# EasyEDA schematic SCH_AVlabs AV-GMK MK I_2024-01-18.json
TITLE: AVlabs AV-GMK MKI; REV: 1.0; Date: 2023-08-29; Sheet: 1/1; Drawn By: Avesta MOLAEI; Company: AVLABS
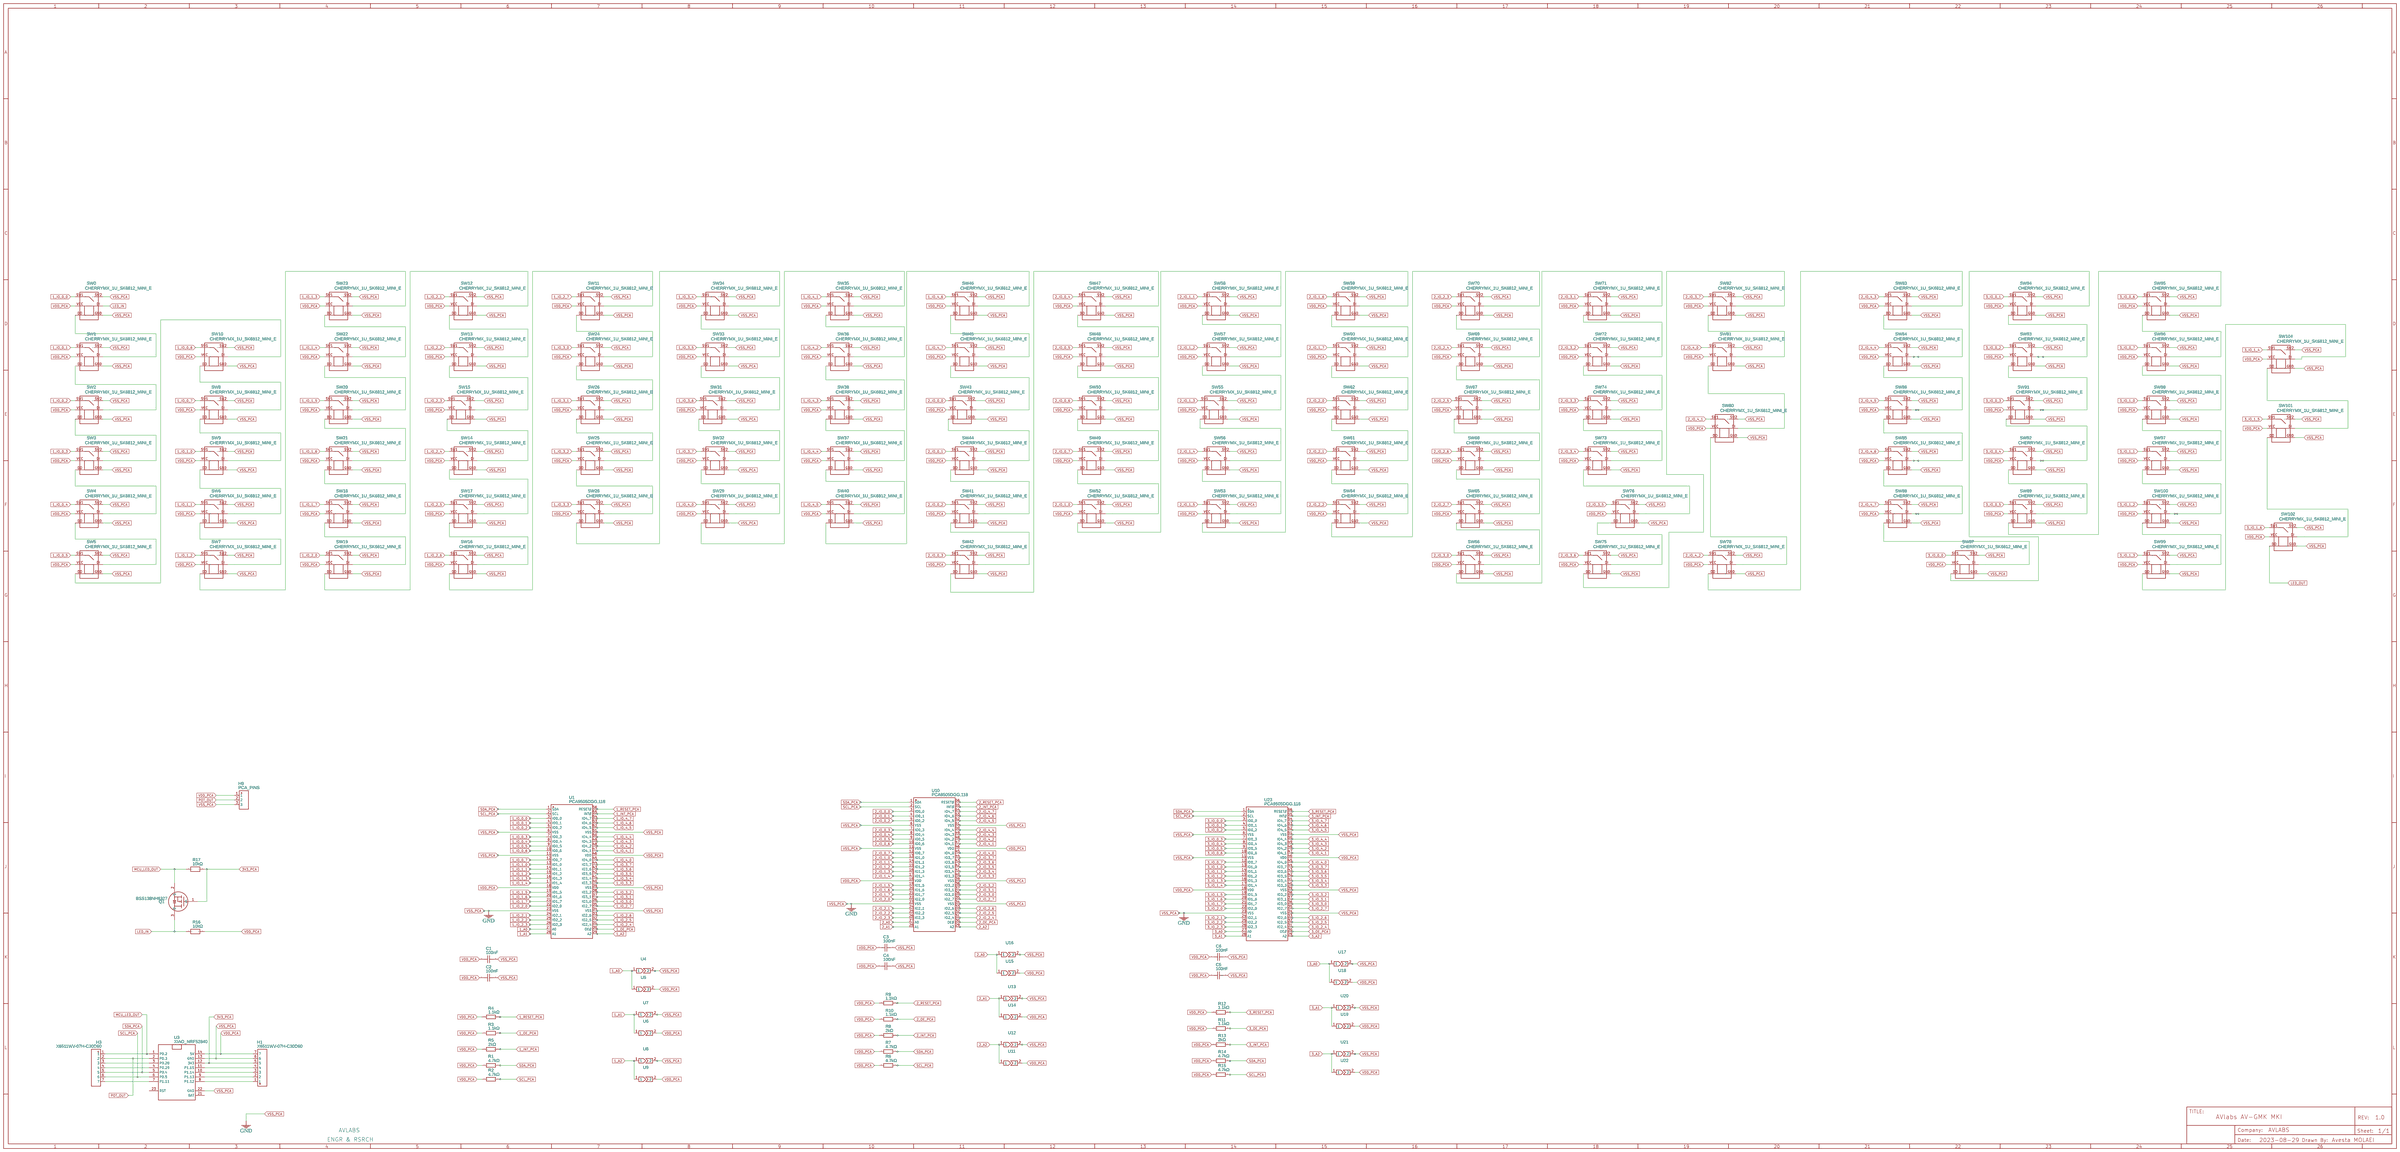
[diagram p0: schematic sheet]

## Parts
C1  100nF  [C0805]
C2  100nF  [C0805]
C3  100nF  [C0805]
C4  100nF  [C0805]
C5  100nF  [C0805]
C6  100nF  [C0805]
H1  X6511WV-07H-C30D60  [HDR-TH_7P-P2.54-V-M]
H3  X6511WV-07H-C30D60  [HDR-TH_7P-P2.54-V-M]
H9  PCA_PINS  [HDR-TH_3P-P2.54-V-M]
Q1  BSS138NH6327  [SOT-23-3_L2.9-W1.3-P1.90-LS2.4-BR]
R1  4.7kΩ  [R0805]
R2  4.7kΩ  [R0805]
R3  1.1kΩ  [R0805]
R4  1.1kΩ  [R0805]
R5  2kΩ  [R0805]
R6  4.7kΩ  [R0805]
R7  4.7kΩ  [R0805]
R8  2kΩ  [R0805]
R9  1.1kΩ  [R0805]
R10  1.1kΩ  [R0805]
R11  1.1kΩ  [R0805]
R12  1.1kΩ  [R0805]
R13  2kΩ  [R0805]
R14  4.7kΩ  [R0805]
R15  4.7kΩ  [R0805]
R16  10kΩ  [R0805]
R17  10kΩ  [R0805]
SW0  CHERRYMX_1U_SK6812_MINI_E  [CHERRYMX_1U_SK6812_MINI-E]
SW1  CHERRYMX_1U_SK6812_MINI_E  [CHERRYMX_1U_SK6812_MINI-E]
SW2  CHERRYMX_1U_SK6812_MINI_E  [CHERRYMX_1U_SK6812_MINI-E]
SW3  CHERRYMX_1U_SK6812_MINI_E  [CHERRYMX_1U_SK6812_MINI-E]
SW4  CHERRYMX_1U_SK6812_MINI_E  [CHERRYMX_1U_SK6812_MINI-E]
SW5  CHERRYMX_1U_SK6812_MINI_E  [CHERRYMX_1U_SK6812_MINI-E]
SW6  CHERRYMX_1U_SK6812_MINI_E  [CHERRYMX_1U_SK6812_MINI-E]
SW7  CHERRYMX_1U_SK6812_MINI_E  [CHERRYMX_1U_SK6812_MINI-E]
SW8  CHERRYMX_1U_SK6812_MINI_E  [CHERRYMX_1U_SK6812_MINI-E]
SW9  CHERRYMX_1U_SK6812_MINI_E  [CHERRYMX_1U_SK6812_MINI-E]
SW10  CHERRYMX_1U_SK6812_MINI_E  [CHERRYMX_1U_SK6812_MINI-E]
SW11  CHERRYMX_1U_SK6812_MINI_E  [CHERRYMX_1U_SK6812_MINI-E]
SW12  CHERRYMX_1U_SK6812_MINI_E  [CHERRYMX_1U_SK6812_MINI-E]
SW13  CHERRYMX_1U_SK6812_MINI_E  [CHERRYMX_1U_SK6812_MINI-E]
SW14  CHERRYMX_1U_SK6812_MINI_E  [CHERRYMX_1U_SK6812_MINI-E]
SW15  CHERRYMX_1U_SK6812_MINI_E  [CHERRYMX_1U_SK6812_MINI-E]
SW16  CHERRYMX_1U_SK6812_MINI_E  [CHERRYMX_1U_SK6812_MINI-E]
SW17  CHERRYMX_1U_SK6812_MINI_E  [CHERRYMX_1U_SK6812_MINI-E]
SW18  CHERRYMX_1U_SK6812_MINI_E  [CHERRYMX_1U_SK6812_MINI-E]
SW19  CHERRYMX_1U_SK6812_MINI_E  [CHERRYMX_1U_SK6812_MINI-E]
SW20  CHERRYMX_1U_SK6812_MINI_E  [CHERRYMX_1U_SK6812_MINI-E]
SW21  CHERRYMX_1U_SK6812_MINI_E  [CHERRYMX_1U_SK6812_MINI-E]
SW22  CHERRYMX_1U_SK6812_MINI_E  [CHERRYMX_1U_SK6812_MINI-E]
SW23  CHERRYMX_1U_SK6812_MINI_E  [CHERRYMX_1U_SK6812_MINI-E]
SW24  CHERRYMX_1U_SK6812_MINI_E  [CHERRYMX_1U_SK6812_MINI-E]
SW25  CHERRYMX_1U_SK6812_MINI_E  [CHERRYMX_1U_SK6812_MINI-E]
SW26  CHERRYMX_1U_SK6812_MINI_E  [CHERRYMX_1U_SK6812_MINI-E]
SW28  CHERRYMX_1U_SK6812_MINI_E  [CHERRYMX_1U_SK6812_MINI-E]
SW29  CHERRYMX_1U_SK6812_MINI_E  [CHERRYMX_1U_SK6812_MINI-E]
SW31  CHERRYMX_1U_SK6812_MINI_E  [CHERRYMX_1U_SK6812_MINI-E]
SW32  CHERRYMX_1U_SK6812_MINI_E  [CHERRYMX_1U_SK6812_MINI-E]
SW33  CHERRYMX_1U_SK6812_MINI_E  [CHERRYMX_1U_SK6812_MINI-E]
SW34  CHERRYMX_1U_SK6812_MINI_E  [CHERRYMX_1U_SK6812_MINI-E]
SW35  CHERRYMX_1U_SK6812_MINI_E  [CHERRYMX_1U_SK6812_MINI-E]
SW36  CHERRYMX_1U_SK6812_MINI_E  [CHERRYMX_1U_SK6812_MINI-E]
SW37  CHERRYMX_1U_SK6812_MINI_E  [CHERRYMX_1U_SK6812_MINI-E]
SW38  CHERRYMX_1U_SK6812_MINI_E  [CHERRYMX_1U_SK6812_MINI-E]
SW40  CHERRYMX_1U_SK6812_MINI_E  [CHERRYMX_1U_SK6812_MINI-E]
SW41  CHERRYMX_1U_SK6812_MINI_E  [CHERRYMX_1U_SK6812_MINI-E]
SW42  CHERRYMX_1U_SK6812_MINI_E  [CHERRYMX_1U_SK6812_MINI-E]
SW43  CHERRYMX_1U_SK6812_MINI_E  [CHERRYMX_1U_SK6812_MINI-E]
SW44  CHERRYMX_1U_SK6812_MINI_E  [CHERRYMX_1U_SK6812_MINI-E]
SW45  CHERRYMX_1U_SK6812_MINI_E  [CHERRYMX_1U_SK6812_MINI-E]
SW46  CHERRYMX_1U_SK6812_MINI_E  [CHERRYMX_1U_SK6812_MINI-E]
SW47  CHERRYMX_1U_SK6812_MINI_E  [CHERRYMX_1U_SK6812_MINI-E]
SW48  CHERRYMX_1U_SK6812_MINI_E  [CHERRYMX_1U_SK6812_MINI-E]
SW49  CHERRYMX_1U_SK6812_MINI_E  [CHERRYMX_1U_SK6812_MINI-E]
SW50  CHERRYMX_1U_SK6812_MINI_E  [CHERRYMX_1U_SK6812_MINI-E]
SW52  CHERRYMX_1U_SK6812_MINI_E  [CHERRYMX_1U_SK6812_MINI-E]
SW53  CHERRYMX_1U_SK6812_MINI_E  [CHERRYMX_1U_SK6812_MINI-E]
SW55  CHERRYMX_1U_SK6812_MINI_E  [CHERRYMX_1U_SK6812_MINI-E]
SW56  CHERRYMX_1U_SK6812_MINI_E  [CHERRYMX_1U_SK6812_MINI-E]
SW57  CHERRYMX_1U_SK6812_MINI_E  [CHERRYMX_1U_SK6812_MINI-E]
SW58  CHERRYMX_1U_SK6812_MINI_E  [CHERRYMX_1U_SK6812_MINI-E]
SW59  CHERRYMX_1U_SK6812_MINI_E  [CHERRYMX_1U_SK6812_MINI-E]
SW60  CHERRYMX_1U_SK6812_MINI_E  [CHERRYMX_1U_SK6812_MINI-E]
SW61  CHERRYMX_1U_SK6812_MINI_E  [CHERRYMX_1U_SK6812_MINI-E]
SW62  CHERRYMX_1U_SK6812_MINI_E  [CHERRYMX_1U_SK6812_MINI-E]
SW64  CHERRYMX_1U_SK6812_MINI_E  [CHERRYMX_1U_SK6812_MINI-E]
SW65  CHERRYMX_1U_SK6812_MINI_E  [CHERRYMX_1U_SK6812_MINI-E]
SW66  CHERRYMX_1U_SK6812_MINI_E  [CHERRYMX_1U_SK6812_MINI-E]
SW67  CHERRYMX_1U_SK6812_MINI_E  [CHERRYMX_1U_SK6812_MINI-E]
SW68  CHERRYMX_1U_SK6812_MINI_E  [CHERRYMX_1U_SK6812_MINI-E]
SW69  CHERRYMX_1U_SK6812_MINI_E  [CHERRYMX_1U_SK6812_MINI-E]
SW70  CHERRYMX_1U_SK6812_MINI_E  [CHERRYMX_1U_SK6812_MINI-E]
SW71  CHERRYMX_1U_SK6812_MINI_E  [CHERRYMX_1U_SK6812_MINI-E]
SW72  CHERRYMX_1U_SK6812_MINI_E  [CHERRYMX_1U_SK6812_MINI-E]
SW73  CHERRYMX_1U_SK6812_MINI_E  [CHERRYMX_1U_SK6812_MINI-E]
SW74  CHERRYMX_1U_SK6812_MINI_E  [CHERRYMX_1U_SK6812_MINI-E]
SW75  CHERRYMX_1U_SK6812_MINI_E  [CHERRYMX_1U_SK6812_MINI-E]
SW76  CHERRYMX_1U_SK6812_MINI_E  [CHERRYMX_1U_SK6812_MINI-E]
SW78  CHERRYMX_1U_SK6812_MINI_E  [CHERRYMX_1U_SK6812_MINI-E]
SW80  CHERRYMX_1U_SK6812_MINI_E  [CHERRYMX_1U_SK6812_MINI-E]
SW81  CHERRYMX_1U_SK6812_MINI_E  [CHERRYMX_1U_SK6812_MINI-E]
SW82  CHERRYMX_1U_SK6812_MINI_E  [CHERRYMX_1U_SK6812_MINI-E]
SW83  CHERRYMX_1U_SK6812_MINI_E  [CHERRYMX_1U_SK6812_MINI-E]
SW84  CHERRYMX_1U_SK6812_MINI_E  [CHERRYMX_1U_SK6812_MINI-E]
SW85  CHERRYMX_1U_SK6812_MINI_E  [CHERRYMX_1U_SK6812_MINI-E]
SW86  CHERRYMX_1U_SK6812_MINI_E  [CHERRYMX_1U_SK6812_MINI-E]
SW87  CHERRYMX_1U_SK6812_MINI_E  [CHERRYMX_1U_SK6812_MINI-E]
SW88  CHERRYMX_1U_SK6812_MINI_E  [CHERRYMX_1U_SK6812_MINI-E]
SW89  CHERRYMX_1U_SK6812_MINI_E  [CHERRYMX_1U_SK6812_MINI-E]
SW91  CHERRYMX_1U_SK6812_MINI_E  [CHERRYMX_1U_SK6812_MINI-E]
SW92  CHERRYMX_1U_SK6812_MINI_E  [CHERRYMX_1U_SK6812_MINI-E]
SW93  CHERRYMX_1U_SK6812_MINI_E  [CHERRYMX_1U_SK6812_MINI-E]
SW94  CHERRYMX_1U_SK6812_MINI_E  [CHERRYMX_1U_SK6812_MINI-E]
SW95  CHERRYMX_1U_SK6812_MINI_E  [CHERRYMX_1U_SK6812_MINI-E]
SW96  CHERRYMX_1U_SK6812_MINI_E  [CHERRYMX_1U_SK6812_MINI-E]
SW97  CHERRYMX_1U_SK6812_MINI_E  [CHERRYMX_1U_SK6812_MINI-E]
SW98  CHERRYMX_1U_SK6812_MINI_E  [CHERRYMX_1U_SK6812_MINI-E]
SW99  CHERRYMX_1U_SK6812_MINI_E  [CHERRYMX_1U_SK6812_MINI-E]
SW100  CHERRYMX_1U_SK6812_MINI_E  [CHERRYMX_1U_SK6812_MINI-E]
SW101  CHERRYMX_1U_SK6812_MINI_E  [CHERRYMX_1U_SK6812_MINI-E]
SW102  CHERRYMX_1U_SK6812_MINI_E  [CHERRYMX_1U_SK6812_MINI-E]
SW104  CHERRYMX_1U_SK6812_MINI_E  [CHERRYMX_1U_SK6812_MINI-E]
U1  PCA9505DGG,118  [TSSOP-56_L14.0-W6.1-P0.50-LS8.1-BL]
U3  XIAO_NRF52840  [XIAO-NRF52840]
U4  beautiful-solderbridge  [BEAUTIFUL-SOLDER-BRIDGE]
U5  beautiful-solderbridge  [BEAUTIFUL-SOLDER-BRIDGE]
U6  beautiful-solderbridge  [BEAUTIFUL-SOLDER-BRIDGE]
U7  beautiful-solderbridge  [BEAUTIFUL-SOLDER-BRIDGE]
U8  beautiful-solderbridge  [BEAUTIFUL-SOLDER-BRIDGE]
U9  beautiful-solderbridge  [BEAUTIFUL-SOLDER-BRIDGE]
U10  PCA9505DGG,118  [TSSOP-56_L14.0-W6.1-P0.50-LS8.1-BL]
U11  beautiful-solderbridge  [BEAUTIFUL-SOLDER-BRIDGE]
U12  beautiful-solderbridge  [BEAUTIFUL-SOLDER-BRIDGE]
U13  beautiful-solderbridge  [BEAUTIFUL-SOLDER-BRIDGE]
U14  beautiful-solderbridge  [BEAUTIFUL-SOLDER-BRIDGE]
U15  beautiful-solderbridge  [BEAUTIFUL-SOLDER-BRIDGE]
U16  beautiful-solderbridge  [BEAUTIFUL-SOLDER-BRIDGE]
U17  beautiful-solderbridge  [BEAUTIFUL-SOLDER-BRIDGE]
U18  beautiful-solderbridge  [BEAUTIFUL-SOLDER-BRIDGE]
U19  beautiful-solderbridge  [BEAUTIFUL-SOLDER-BRIDGE]
U20  beautiful-solderbridge  [BEAUTIFUL-SOLDER-BRIDGE]
U21  beautiful-solderbridge  [BEAUTIFUL-SOLDER-BRIDGE]
U22  beautiful-solderbridge  [BEAUTIFUL-SOLDER-BRIDGE]
U23  PCA9505DGG,118  [TSSOP-56_L14.0-W6.1-P0.50-LS8.1-BL]

## Library data of the parts
C1-C6 = GRM21BR71H104KA01L: Supplier: LCSC; Manufacturer: muRata(村田); Supplier Part: C77082; JLCPCB Part Class: Extended Part
H1 H3 = X6511WV-07H-C30D60: Supplier: LCSC; Supplier Part: C706879; Manufacturer: XKB Connectivity(中国星坤); Contributor: LCSC; JLCPCB Part Class: Extended Part
H9 = X6511WV-03H-C30D60: Supplier: LCSC; Supplier Part: C706875; Manufacturer: XKB Connectivity(中国星坤); Contributor: LCSC; JLCPCB Part Class: Extended Part
Q1 = BSS138NH6327: Contributor: LCSC; Supplier: LCSC; Manufacturer: Infineon(英飞凌); Supplier Part: C94638; JLCPCB Part Class: Extended Part; link: https://lcsc.com/eda_search?q=C94638&%26type=1&ref=editor
R1 R2 R6 R7 R14 R15 = RN732ATTD4701B25: Supplier: LCSC; Supplier Part: C186491; Manufacturer: KOA; Resistance (Ohms): 4.7K; Contributor: LCSC; JLCPCB Part Class: Extended Part
R3 R4 R9-R12 = RN732ATTD1101B25: Supplier: LCSC; Supplier Part: C186476; Manufacturer: KOA; Resistance (Ohms): 1.1K; Contributor: LCSC; JLCPCB Part Class: Extended Part
R5 R8 R13 = RN732ATTD2001B25: Supplier: LCSC; Supplier Part: C186482; Manufacturer: KOA; Resistance (Ohms): 2K; Contributor: LCSC; JLCPCB Part Class: Extended Part
R16 R17 = RN732ATTD1002B10: Contributor: LCSC; Supplier: LCSC; Supplier Part: C782227; Manufacturer: KOA; JLCPCB Part Class: Extended Part; link: https://lcsc.com/eda_search?q=C782227&%26type=1&ref=editor
SW0-SW26 SW28 SW29 SW31-SW38 SW40-SW50 SW52 SW53 SW55-SW62 SW64-SW76 SW78 SW80-SW89 SW91-SW102 SW104 = CHERRYMX_1U_SK6812_MINI_E: Contributor: Andrea Peron
U1 U10 U23 = PCA9505DGG,118: Supplier: LCSC; Supplier Part: C2669685; Manufacturer: NXP(恩智浦); Contributor: LCSC; JLCPCB Part Class: Extended Part
U3 = XIAO_NRF52840: Contributor: Kushal Soni
U4-U9 U11-U22 = beautiful-solderbridge: Contributor: loic.rochat

## Nets
3V3_PCA: H1.5 Q1.1(G) R17.2 U3.12(3V3)
GND: C1.2 C2.2 C3.2 C4.2 C5.2 C6.2 H1.6 H9.3 SW0.GND SW0.SW2 SW1.GND SW1.SW2 SW2.GND SW2.SW2 SW3.GND SW3.SW2 SW4.GND SW4.SW2 SW5.GND SW5.SW2 SW6.GND SW6.SW2 SW7.GND SW7.SW2 SW8.GND SW8.SW2 SW9.GND SW9.SW2 SW10.GND SW10.SW2 SW11.GND SW11.SW2 SW12.GND SW12.SW2 SW13.GND SW13.SW2 SW14.GND SW14.SW2 SW15.GND SW15.SW2 SW16.GND SW16.SW2 SW17.GND SW17.SW2 SW18.GND SW18.SW2 SW19.GND SW19.SW2 SW20.GND SW20.SW2 SW21.GND SW21.SW2 SW22.GND SW22.SW2 SW23.GND SW23.SW2 SW24.GND SW24.SW2 SW25.GND SW25.SW2 SW26.GND SW26.SW2 SW28.GND SW28.SW2 SW29.GND SW29.SW2 SW31.GND SW31.SW2 SW32.GND SW32.SW2 SW33.GND SW33.SW2 SW34.GND SW34.SW2 SW35.GND SW35.SW2 SW36.GND SW36.SW2 SW37.GND SW37.SW2 SW38.GND SW38.SW2 SW40.GND SW40.SW2 SW41.GND SW41.SW2 SW42.GND SW42.SW2 SW43.GND SW43.SW2 SW44.GND SW44.SW2 SW45.GND SW45.SW2 SW46.GND SW46.SW2 SW47.GND SW47.SW2 SW48.GND SW48.SW2 SW49.GND SW49.SW2 SW50.GND SW50.SW2 SW52.GND SW52.SW2 SW53.GND SW53.SW2 SW55.GND SW55.SW2 SW56.GND SW56.SW2 SW57.GND SW57.SW2 SW58.GND SW58.SW2 SW59.GND SW59.SW2 SW60.GND SW60.SW2 SW61.GND SW61.SW2 SW62.GND SW62.SW2 SW64.GND SW64.SW2 SW65.GND SW65.SW2 SW66.GND SW66.SW2 SW67.GND SW67.SW2 SW68.GND SW68.SW2 SW69.GND SW69.SW2 SW70.GND SW70.SW2 SW71.GND SW71.SW2 SW72.GND SW72.SW2 SW73.GND SW73.SW2 SW74.GND SW74.SW2 SW75.GND SW75.SW2 SW76.GND SW76.SW2 SW78.GND SW78.SW2 SW80.GND SW80.SW2 SW81.GND SW81.SW2 SW82.GND SW82.SW2 SW83.GND SW83.SW2 SW84.GND SW84.SW2 SW85.GND SW85.SW2 SW86.GND SW86.SW2 SW87.GND SW87.SW2 SW88.GND SW88.SW2 SW89.GND SW89.SW2 SW91.GND SW91.SW2 SW92.GND SW92.SW2 SW93.GND SW93.SW2 SW94.GND SW94.SW2 SW95.GND SW95.SW2 SW96.GND SW96.SW2 SW97.GND SW97.SW2 SW98.GND SW98.SW2 SW99.GND SW99.SW2 SW100.GND SW100.SW2 SW101.GND SW101.SW2 SW102.GND SW102.SW2 SW104.GND SW104.SW2 U1.6(VSS) U1.11(VSS) U1.23(VSS) U1.34(VSS) U1.39(VSS) U1.51(VSS) U3.13(GND) U3.22(GND) U4.2 U7.2 U8.2 U10.6(VSS) U10.11(VSS) U10.23(VSS) U10.34(VSS) U10.39(VSS) U10.51(VSS) U12.2 U13.2 U16.2 U17.2 U20.2 U21.2 U23.6(VSS) U23.11(VSS) U23.23(VSS) U23.34(VSS) U23.39(VSS) U23.51(VSS)
VDD_PCA: C1.1 C2.1 C3.1 C4.1 C5.1 C6.1 H1.7 H9.1 R1.1 R2.1 R3.1 R4.1 R5.1 R6.1 R7.1 R8.1 R9.1 R10.1 R11.1 R12.1 R13.1 R14.1 R15.1 R16.2 SW0.VCC SW1.VCC SW2.VCC SW3.VCC SW4.VCC SW5.VCC SW6.VCC SW7.VCC SW8.VCC SW9.VCC SW10.VCC SW11.VCC SW12.VCC SW13.VCC SW14.VCC SW15.VCC SW16.VCC SW17.VCC SW18.VCC SW19.VCC SW20.VCC SW21.VCC SW22.VCC SW23.VCC SW24.VCC SW25.VCC SW26.VCC SW28.VCC SW29.VCC SW31.VCC SW32.VCC SW33.VCC SW34.VCC SW35.VCC SW36.VCC SW37.VCC SW38.VCC SW40.VCC SW41.VCC SW42.VCC SW43.VCC SW44.VCC SW45.VCC SW46.VCC SW47.VCC SW48.VCC SW49.VCC SW50.VCC SW52.VCC SW53.VCC SW55.VCC SW56.VCC SW57.VCC SW58.VCC SW59.VCC SW60.VCC SW61.VCC SW62.VCC SW64.VCC SW65.VCC SW66.VCC SW67.VCC SW68.VCC SW69.VCC SW70.VCC SW71.VCC SW72.VCC SW73.VCC SW74.VCC SW75.VCC SW76.VCC SW78.VCC SW80.VCC SW81.VCC SW82.VCC SW83.VCC SW84.VCC SW85.VCC SW86.VCC SW87.VCC SW88.VCC SW89.VCC SW91.VCC SW92.VCC SW93.VCC SW94.VCC SW95.VCC SW96.VCC SW97.VCC SW98.VCC SW99.VCC SW100.VCC SW101.VCC SW102.VCC SW104.VCC U1.18(VDD) U1.46(VDD) U3.14(5V) U5.2 U6.2 U9.2 U10.18(VDD) U10.46(VDD) U11.2 U14.2 U15.2 U18.2 U19.2 U22.2 U23.18(VDD) U23.46(VDD)
1_A0: U1.27(A0) U4.1 U5.1
1_A1: U1.28(A1) U6.1 U7.1
1_A2: U1.29(A2) U8.1 U9.1
1_INT_PCA: R5.2 U1.55(INT#)
1_IO_0_0: SW0.SW1 U1.3(IO0_0)
1_IO_0_1: SW1.SW1 U1.4(IO0_1)
1_IO_0_2: SW2.SW1 U1.5(IO0_2)
1_IO_0_3: SW3.SW1 U1.7(IO0_3)
1_IO_0_4: SW4.SW1 U1.8(IO0_4)
1_IO_0_5: SW5.SW1 U1.9(IO0_5)
1_IO_0_6: SW10.SW1 U1.10(IO0_6)
1_IO_0_7: SW8.SW1 U1.12(IO0_7)
1_IO_1_0: SW9.SW1 U1.13(IO1_0)
1_IO_1_1: SW6.SW1 U1.14(IO1_1)
1_IO_1_2: SW7.SW1 U1.15(IO1_2)
1_IO_1_3: SW23.SW1 U1.16(IO1_3)
1_IO_1_4: SW22.SW1 U1.17(IO1_4)
1_IO_1_5: SW20.SW1 U1.19(IO1_5)
1_IO_1_6: SW21.SW1 U1.20(IO1_6)
1_IO_1_7: SW18.SW1 U1.21(IO1_7)
1_IO_2_0: SW19.SW1 U1.22(IO2_0)
1_IO_2_1: SW12.SW1 U1.24(IO2_1)
1_IO_2_2: SW13.SW1 U1.25(IO2_2)
1_IO_2_3: SW15.SW1 U1.26(IO2_3)
1_IO_2_4: SW14.SW1 U1.31(IO2_4)
1_IO_2_5: SW17.SW1 U1.32(IO2_5)
1_IO_2_6: SW16.SW1 U1.33(IO2_6)
1_IO_2_7: SW11.SW1 U1.35(IO2_7)
1_IO_3_0: SW24.SW1 U1.36(IO3_0)
1_IO_3_1: SW26.SW1 U1.37(IO3_1)
1_IO_3_2: SW25.SW1 U1.38(IO3_2)
1_IO_3_3: SW28.SW1 U1.40(IO3_3)
1_IO_3_4: SW34.SW1 U1.41(IO3_4)
1_IO_3_5: SW33.SW1 U1.42(IO3_5)
1_IO_3_6: SW31.SW1 U1.43(IO3_6)
1_IO_3_7: SW32.SW1 U1.44(IO3_7)
1_IO_4_0: SW29.SW1 U1.45(IO4_0)
1_IO_4_1: SW35.SW1 U1.47(IO4_1)
1_IO_4_2: SW36.SW1 U1.48(IO4_2)
1_IO_4_3: SW38.SW1 U1.49(IO4_3)
1_IO_4_4: SW37.SW1 U1.50(IO4_4)
1_IO_4_5: SW40.SW1 U1.52(IO4_5)
1_IO_4_6: SW46.SW1 U1.53(IO4_6)
1_IO_4_7: SW45.SW1 U1.54(IO4_7)
1_OE_PCA: R3.2 U1.30(OE#)
1_RESET_PCA: R4.2 U1.56(RESET#)
2_A0: U10.27(A0) U15.1 U16.1
2_A1: U10.28(A1) U13.1 U14.1
2_A2: U10.29(A2) U11.1 U12.1
2_INT_PCA: R8.2 U10.55(INT#)
2_IO_0_0: SW43.SW1 U10.3(IO0_0)
2_IO_0_1: SW44.SW1 U10.4(IO0_1)
2_IO_0_2: SW41.SW1 U10.5(IO0_2)
2_IO_0_3: SW42.SW1 U10.7(IO0_3)
2_IO_0_4: SW47.SW1 U10.8(IO0_4)
2_IO_0_5: SW48.SW1 U10.9(IO0_5)
2_IO_0_6: SW50.SW1 U10.10(IO0_6)
2_IO_0_7: SW49.SW1 U10.12(IO0_7)
2_IO_1_0: SW52.SW1 U10.13(IO1_0)
2_IO_1_1: SW58.SW1 U10.14(IO1_1)
2_IO_1_2: SW57.SW1 U10.15(IO1_2)
2_IO_1_3: SW55.SW1 U10.16(IO1_3)
2_IO_1_4: SW56.SW1 U10.17(IO1_4)
2_IO_1_5: SW53.SW1 U10.19(IO1_5)
2_IO_1_6: SW59.SW1 U10.20(IO1_6)
2_IO_1_7: SW60.SW1 U10.21(IO1_7)
2_IO_2_0: SW62.SW1 U10.22(IO2_0)
2_IO_2_1: SW61.SW1 U10.24(IO2_1)
2_IO_2_2: SW64.SW1 U10.25(IO2_2)
2_IO_2_3: SW70.SW1 U10.26(IO2_3)
2_IO_2_4: SW69.SW1 U10.31(IO2_4)
2_IO_2_5: SW67.SW1 U10.32(IO2_5)
2_IO_2_6: SW68.SW1 U10.33(IO2_6)
2_IO_2_7: SW65.SW1 U10.35(IO2_7)
2_IO_3_0: SW66.SW1 U10.36(IO3_0)
2_IO_3_1: SW71.SW1 U10.37(IO3_1)
2_IO_3_2: SW72.SW1 U10.38(IO3_2)
2_IO_3_3: SW74.SW1 U10.40(IO3_3)
2_IO_3_4: SW73.SW1 U10.41(IO3_4)
2_IO_3_5: SW76.SW1 U10.42(IO3_5)
2_IO_3_6: SW75.SW1 U10.43(IO3_6)
2_IO_3_7: SW82.SW1 U10.44(IO3_7)
2_IO_4_0: SW81.SW1 U10.45(IO4_0)
2_IO_4_1: SW80.SW1 U10.47(IO4_1)
2_IO_4_2: SW78.SW1 U10.48(IO4_2)
2_IO_4_3: SW83.SW1 U10.49(IO4_3)
2_IO_4_4: SW84.SW1 U10.50(IO4_4)
2_IO_4_5: SW86.SW1 U10.52(IO4_5)
2_IO_4_6: SW85.SW1 U10.53(IO4_6)
2_IO_4_7: SW88.SW1 U10.54(IO4_7)
2_OE_PCA: R10.2 U10.30(OE#)
2_RESET_PCA: R9.2 U10.56(RESET#)
3_A0: U17.1 U18.1 U23.27(A0)
3_A1: U19.1 U20.1 U23.28(A1)
3_A2: U21.1 U22.1 U23.29(A2)
3_INT_PCA: R13.2 U23.55(INT#)
3_IO_0_0: SW87.SW1 U23.3(IO0_0)
3_IO_0_1: SW94.SW1 U23.4(IO0_1)
3_IO_0_2: SW93.SW1 U23.5(IO0_2)
3_IO_0_3: SW91.SW1 U23.7(IO0_3)
3_IO_0_4: SW92.SW1 U23.8(IO0_4)
3_IO_0_5: SW89.SW1 U23.9(IO0_5)
3_IO_0_6: SW95.SW1 U23.10(IO0_6)
3_IO_0_7: SW96.SW1 U23.12(IO0_7)
3_IO_1_0: SW98.SW1 U23.13(IO1_0)
3_IO_1_1: SW97.SW1 U23.14(IO1_1)
3_IO_1_2: SW100.SW1 U23.15(IO1_2)
3_IO_1_3: SW99.SW1 U23.16(IO1_3)
3_IO_1_4: SW104.SW1 U23.17(IO1_4)
3_IO_1_5: SW101.SW1 U23.19(IO1_5)
3_IO_1_6: SW102.SW1 U23.20(IO1_6)
3_IO_1_7: U23.21(IO1_7)
3_IO_2_0: U23.22(IO2_0)
3_IO_2_1: U23.24(IO2_1)
3_IO_2_2: U23.25(IO2_2)
3_IO_2_3: U23.26(IO2_3)
3_IO_2_4: U23.31(IO2_4)
3_IO_2_5: U23.32(IO2_5)
3_IO_2_6: U23.33(IO2_6)
3_IO_2_7: U23.35(IO2_7)
3_IO_3_0: U23.36(IO3_0)
3_IO_3_1: U23.37(IO3_1)
3_IO_3_2: U23.38(IO3_2)
3_IO_3_3: U23.40(IO3_3)
3_IO_3_4: U23.41(IO3_4)
3_IO_3_5: U23.42(IO3_5)
3_IO_3_6: U23.43(IO3_6)
3_IO_3_7: U23.44(IO3_7)
3_IO_4_0: U23.45(IO4_0)
3_IO_4_1: U23.47(IO4_1)
3_IO_4_2: U23.48(IO4_2)
3_IO_4_3: U23.49(IO4_3)
3_IO_4_4: U23.50(IO4_4)
3_IO_4_5: U23.52(IO4_5)
3_IO_4_6: U23.53(IO4_6)
3_IO_4_7: U23.54(IO4_7)
3_OE_PCA: R11.2 U23.30(OE#)
3_RESET_PCA: R12.2 U23.56(RESET#)
LED_IN: Q1.3(D) R16.1 SW0.DI
LED_OUT: SW102.DO
MCU_LED_OUT: H3.1 Q1.2(S) R17.1 U3.1(P0.2)
POT_OUT: H3.2 H9.2 U3.2(P0.3)
SCL_PCA: H3.6 R2.2 R6.2 R15.2 U1.2(SCL) U3.6(P0.5) U10.2(SCL) U23.2(SCL)
SDA_PCA: H3.5 R1.2 R7.2 R14.2 U1.1(SDA) U3.5(P0.4) U10.1(SDA) U23.1(SDA)
Net-(H1-1): H1.1 U3.8(P1.12)
Net-(H1-2): H1.2 U3.9(P1.13)
Net-(H1-3): H1.3 U3.10(P1.14)
Net-(H1-4): H1.4 U3.11(P1.15)
Net-(H3-3): H3.3 U3.3(P0.28)
Net-(H3-4): H3.4 U3.4(P0.29)
Net-(H3-7): H3.7 U3.7(P1.11)
Net-(SW0-DO): SW0.DO SW1.DI
Net-(SW1-DO): SW1.DO SW2.DI
Net-(SW2-DO): SW2.DO SW3.DI
Net-(SW3-DO): SW3.DO SW4.DI
Net-(SW4-DO): SW4.DO SW5.DI
Net-(SW5-DO): SW5.DO SW10.DI
Net-(SW6-DI): SW6.DI SW9.DO
Net-(SW6-DO): SW6.DO SW7.DI
Net-(SW7-DO): SW7.DO SW23.DI
Net-(SW8-DI): SW8.DI SW10.DO
Net-(SW8-DO): SW8.DO SW9.DI
Net-(SW11-DI): SW11.DI SW16.DO
Net-(SW11-DO): SW11.DO SW24.DI
Net-(SW12-DI): SW12.DI SW19.DO
Net-(SW12-DO): SW12.DO SW13.DI
Net-(SW13-DO): SW13.DO SW15.DI
Net-(SW14-DI): SW14.DI SW15.DO
Net-(SW14-DO): SW14.DO SW17.DI
Net-(SW16-DI): SW16.DI SW17.DO
Net-(SW18-DI): SW18.DI SW21.DO
Net-(SW18-DO): SW18.DO SW19.DI
Net-(SW20-DI): SW20.DI SW22.DO
Net-(SW20-DO): SW20.DO SW21.DI
Net-(SW22-DI): SW22.DI SW23.DO
Net-(SW24-DO): SW24.DO SW26.DI
Net-(SW25-DI): SW25.DI SW26.DO
Net-(SW25-DO): SW25.DO SW28.DI
Net-(SW28-DO): SW28.DO SW34.DI
Net-(SW29-DI): SW29.DI SW32.DO
Net-(SW29-DO): SW29.DO SW35.DI
Net-(SW31-DI): SW31.DI SW33.DO
Net-(SW31-DO): SW31.DO SW32.DI
Net-(SW33-DI): SW33.DI SW34.DO
Net-(SW35-DO): SW35.DO SW36.DI
Net-(SW36-DO): SW36.DO SW38.DI
Net-(SW37-DI): SW37.DI SW38.DO
Net-(SW37-DO): SW37.DO SW40.DI
Net-(SW40-DO): SW40.DO SW46.DI
Net-(SW41-DI): SW41.DI SW44.DO
Net-(SW41-DO): SW41.DO SW42.DI
Net-(SW42-DO): SW42.DO SW47.DI
Net-(SW43-DI): SW43.DI SW45.DO
Net-(SW43-DO): SW43.DO SW44.DI
Net-(SW45-DI): SW45.DI SW46.DO
Net-(SW47-DO): SW47.DO SW48.DI
Net-(SW48-DO): SW48.DO SW50.DI
Net-(SW49-DI): SW49.DI SW50.DO
Net-(SW49-DO): SW49.DO SW52.DI
Net-(SW52-DO): SW52.DO SW58.DI
Net-(SW53-DI): SW53.DI SW56.DO
Net-(SW53-DO): SW53.DO SW59.DI
Net-(SW55-DI): SW55.DI SW57.DO
Net-(SW55-DO): SW55.DO SW56.DI
Net-(SW57-DI): SW57.DI SW58.DO
Net-(SW59-DO): SW59.DO SW60.DI
Net-(SW60-DO): SW60.DO SW62.DI
Net-(SW61-DI): SW61.DI SW62.DO
Net-(SW61-DO): SW61.DO SW64.DI
Net-(SW64-DO): SW64.DO SW70.DI
Net-(SW65-DI): SW65.DI SW68.DO
Net-(SW65-DO): SW65.DO SW66.DI
Net-(SW66-DO): SW66.DO SW71.DI
Net-(SW67-DI): SW67.DI SW69.DO
Net-(SW67-DO): SW67.DO SW68.DI
Net-(SW69-DI): SW69.DI SW70.DO
Net-(SW71-DO): SW71.DO SW72.DI
Net-(SW72-DO): SW72.DO SW74.DI
Net-(SW73-DI): SW73.DI SW74.DO
Net-(SW73-DO): SW73.DO SW76.DI
Net-(SW75-DI): SW75.DI SW76.DO
Net-(SW75-DO): SW75.DO SW82.DI
Net-(SW78-DI): SW78.DI SW80.DO
Net-(SW78-DO): SW78.DO SW83.DI
Net-(SW80-DI): SW80.DI SW81.DO
Net-(SW81-DI): SW81.DI SW82.DO
Net-(SW83-DO): SW83.DO SW84.DI
Net-(SW84-DO): SW84.DO SW86.DI
Net-(SW85-DI): SW85.DI SW86.DO
Net-(SW85-DO): SW85.DO SW88.DI
Net-(SW87-DI): SW87.DI SW88.DO
Net-(SW87-DO): SW87.DO SW94.DI
Net-(SW89-DI): SW89.DI SW92.DO
Net-(SW89-DO): SW89.DO SW95.DI
Net-(SW91-DI): SW91.DI SW93.DO
Net-(SW91-DO): SW91.DO SW92.DI
Net-(SW93-DI): SW93.DI SW94.DO
Net-(SW95-DO): SW95.DO SW96.DI
Net-(SW96-DO): SW96.DO SW98.DI
Net-(SW97-DI): SW97.DI SW98.DO
Net-(SW97-DO): SW97.DO SW100.DI
Net-(SW99-DI): SW99.DI SW100.DO
Net-(SW99-DO): SW99.DO SW104.DI
Net-(SW101-DI): SW101.DI SW104.DO
Net-(SW101-DO): SW101.DO SW102.DI

Not connected (* = marked no-connect by the designer): U3 21(BAT) 23(RST)

## Notes on the sheet
- AVLABS
- ENGR & RSRCH
